# EasyEDA schematic 1-Schematic_TL071.json
TITLE: TL072; REV: 1.0; Date: 2022-04-28; Sheet: 1/1; Drawn By: BH2VGM; Company: NEU-ISE
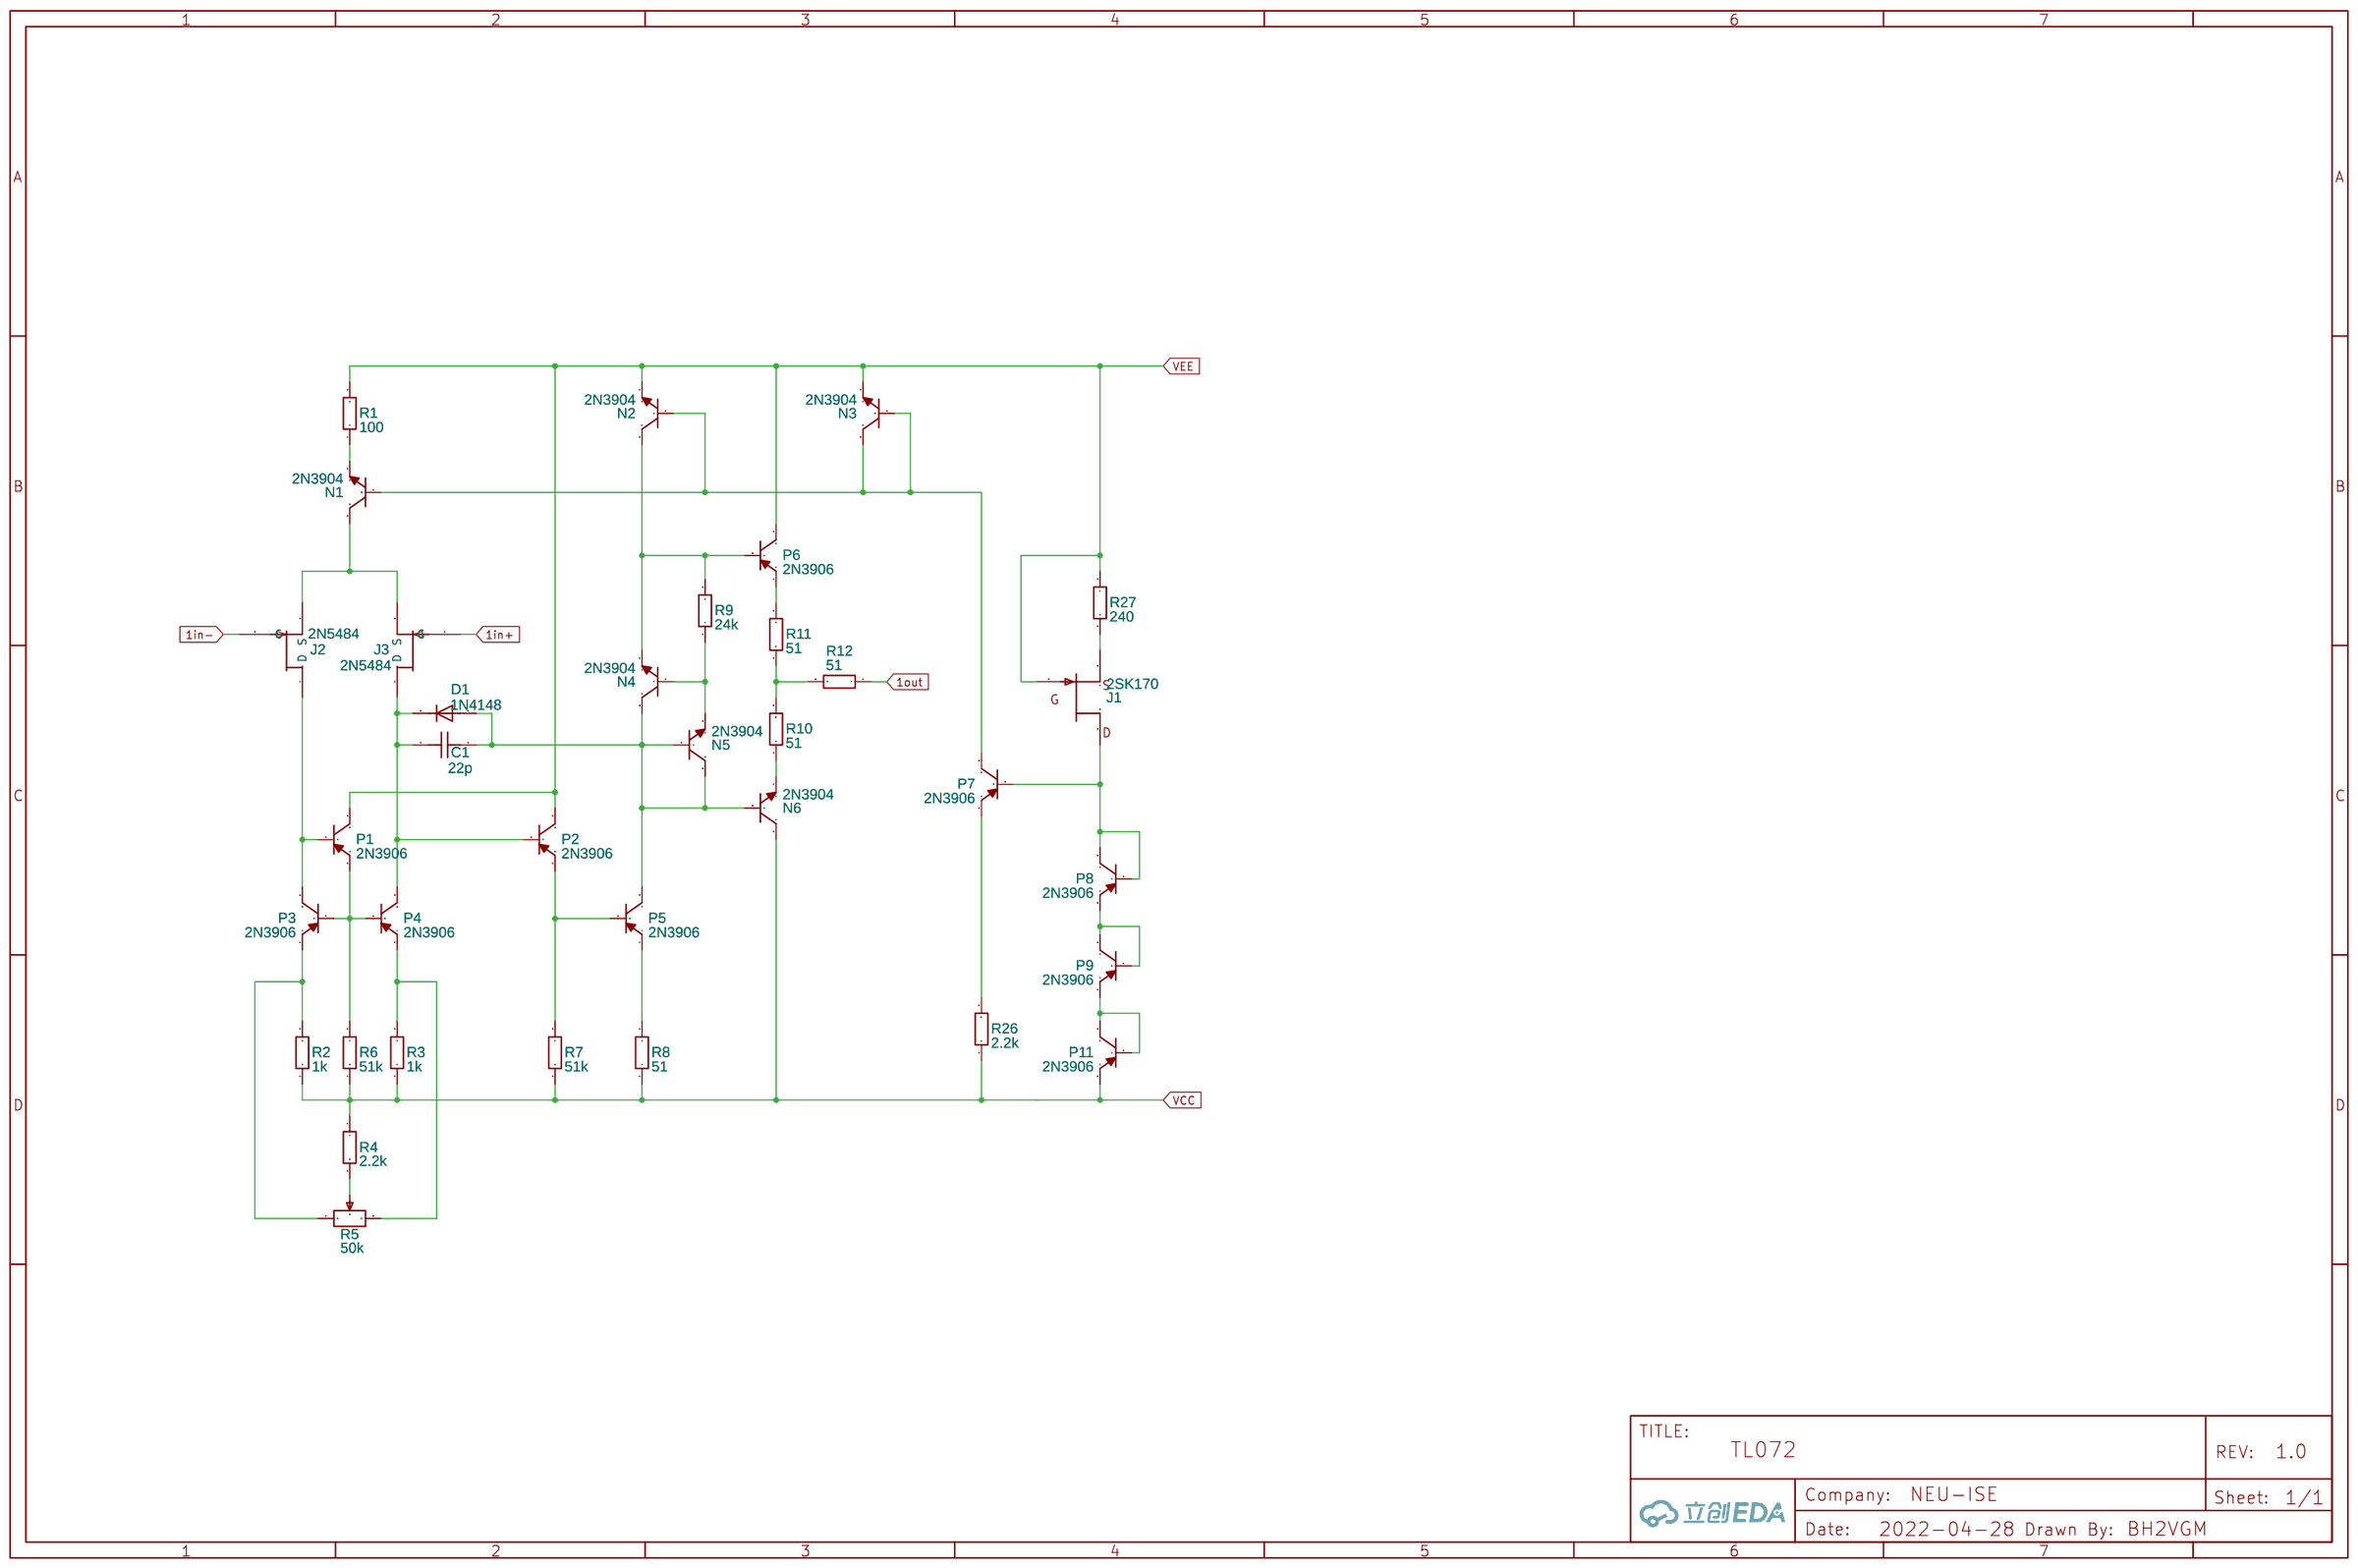
[diagram p0: schematic sheet]

## Parts
C1  22p  [C0805]
D1  1N4148  [DO-35 1N4148]
J1  2SK170  [2SK170]
J2  2N5484  [TO92-2N5484]
J3  2N5484  [TO92-2N5484]
N1  2N3904  [TO-92-3_L5.1-W4.1-P1.27-L]
N2  2N3904  [TO-92-3_L5.1-W4.1-P1.27-L]
N3  2N3904  [TO-92-3_L5.1-W4.1-P1.27-L]
N4  2N3904  [TO-92-3_L5.1-W4.1-P1.27-L]
N5  2N3904  [TO-92-3_L5.1-W4.1-P1.27-L]
N6  2N3904  [TO-92-3_L5.1-W4.1-P1.27-L]
P1  2N3906  [TO-92-3_L5.1-W4.1-P1.27-L]
P2  2N3906  [TO-92-3_L5.1-W4.1-P1.27-L]
P3  2N3906  [TO-92-3_L5.1-W4.1-P1.27-L]
P4  2N3906  [TO-92-3_L5.1-W4.1-P1.27-L]
P5  2N3906  [TO-92-3_L5.1-W4.1-P1.27-L]
P6  2N3906  [TO-92-3_L5.1-W4.1-P1.27-L]
P7  2N3906  [TO-92-3_L5.1-W4.1-P1.27-L]
P8  2N3906  [TO-92-3_L5.1-W4.1-P1.27-L]
P9  2N3906  [TO-92-3_L5.1-W4.1-P1.27-L]
P11  2N3906  [TO-92-3_L5.1-W4.1-P1.27-L]
R1  100  [R0805]
R2  1k  [R0805]
R3  1k  [R0805]
R4  2.2k  [R0805]
R5  50k  [3296W 10ROUND]
R6  51k  [R0805]
R7  51k  [R0805]
R8  51  [R0805]
R9  24k  [R0805]
R10  51  [R0805]
R11  51  [R0805]
R12  51  [R0805]
R26  2.2k  [R0805]
R27  240  [R0805]

## Library data of the parts
C1 = C0805X7R103J500NT: Supplier: LCSC; Supplier Part: C2835540; Manufacturer: SANYEAR(叁叶源); JLCPCB Part Class: Extended Part; Contributor: LCSC
D1 = 1N4148 DO-35: Contributor: king13478509115
J1 = 2SK170: Contributor: king13478509115
J2 J3 = 2N5484: Contributor: king13478509115
N1-N6 = 2N3904: Supplier: LCSC; Manufacturer: SEMTECH; Supplier Part: C118538; JLCPCB Part Class: Extended Part
P1-P9 P11 = 2N3906_C118539: Supplier: LCSC; Manufacturer: SEMTECH; Supplier Part: C118539; JLCPCB Part Class: Extended Part
R1-R4 R6-R12 R26 R27 = 0805: Supplier: LCSC; Supplier Part: C9900012715; Manufacturer: null; link: https://atta.szlcsc.comnull; Contributor: LCSC; JLCPCB Part Class: Extended Part
R5 = 3296W: Supplier: LCSC; Manufacturer: BOURNS; Manufacturer Part: 3296W-1-103LF; Supplier Part: C34846; Resistance(Ohms): 10K; Resistance (Ohms): 10K; JLCPCB Part Class: Extended Part; Contributor: king13478509115

## Nets
VCC: N6.3(C) P11.1 R2.1 R3.1 R4.1 R6.1 R7.1 R8.1 R26.1
VEE: J1.2(G) N2.1(E) N3.1(E) P1.3 P2.3 P6.3 R1.2 R27.1
1in+: J3.3(G)
1in-: J2.3(G)
1out: R12.1
Net-(C1-1): C1.1 D1.2 J3.1(D) P2.2 P4.3
Net-(C1-2): C1.2 D1.1 N4.3(C) N5.2(B) N5.3(C) N6.2(B) P5.3
Net-(J1-1): J1.1(S) R27.2
Net-(J1-3): J1.3(D) P7.2 P8.2 P8.3
Net-(J2-1): J2.1(D) P1.2 P3.3
Net-(J2-2): J2.2(S) J3.2(S) N1.3(C)
Net-(N1-1): N1.1(E) R1.1
Net-(N1-2): N1.2(B) N2.2(B) N3.2(B) N3.3(C) P7.3
Net-(N2-3): N2.3(C) N4.1(E) P6.2 R9.2
Net-(N4-2): N4.2(B) N5.1(E) R9.1
Net-(N6-1): N6.1(E) R10.1
Net-(P1-1): P1.1 P3.2 P4.2 R6.2
Net-(P2-1): P2.1 P5.2 R7.2
Net-(P3-1): P3.1 R2.2 R5.3
Net-(P4-1): P4.1 R3.2 R5.1
Net-(P5-1): P5.1 R8.2
Net-(P6-1): P6.1 R11.2
Net-(P7-1): P7.1 R26.2
Net-(P8-1): P8.1 P9.2 P9.3
Net-(P9-1): P9.1 P11.2 P11.3
Net-(R4-2): R4.2 R5.2
Net-(R10-2): R10.2 R11.1 R12.2
